# EAGLE design octobñpcksBoard (EAGLE 6.5.0)
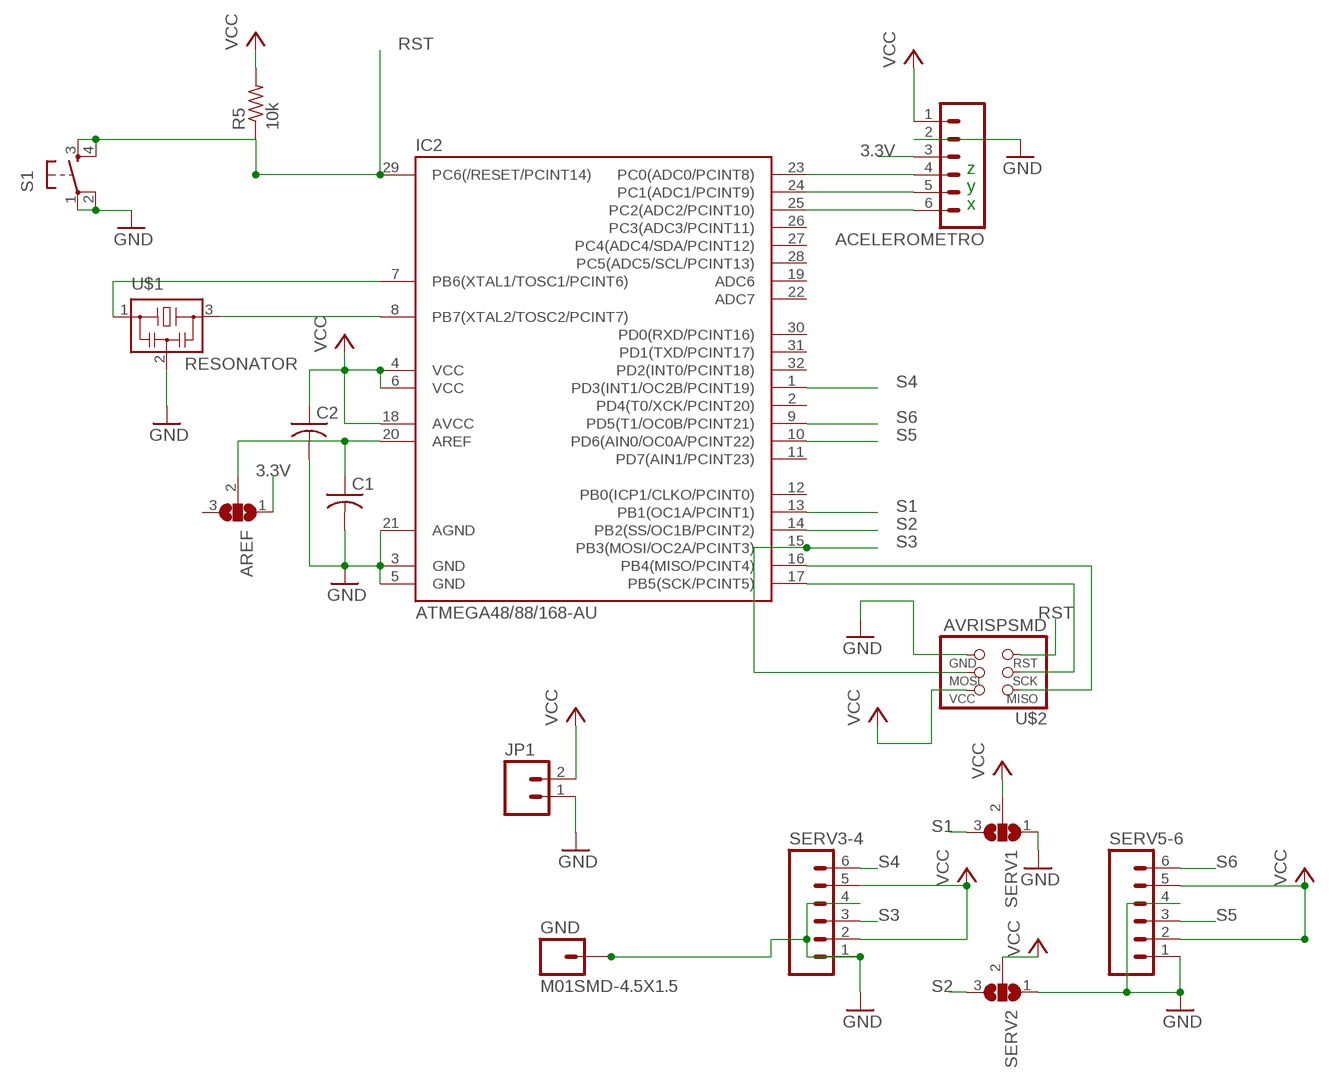
[diagram p0: schematic, sheet 1]

## Parts
ACELEROMETRO  M06SMD  [1X06-SMD]
AREF  SJ2WW  [SJ_2W]
C1  C-USC1206  [C1206]
C2  C-USC1206  [C1206]
GND  M01SMD-4.5X1.5  [PAD-1.5X4.5]
IC2  ATMEGA48/88/168-AU  [TQFP32-08]
JP1  M02  [1X02_LONGPADS]
R5  10k  RESISTOR1206  [1206]
S1  6MM_SWITCH6MM_SWITCH  [6MM_SWITCH]
SERV1  SJ2WW  [SJ_2W]
SERV2  SJ2WW  [SJ_2W]
SERV3-4  M06SMD  [1X06-SMD]
SERV5-6  M06SMD  [1X06-SMD]
U$1  RESONATOR  [EFOBM]
U$2  AVRISPSMD  [2X03SMD]

## Nets
3.3V: ACELEROMETRO.3 AREF.1
GND: ACELEROMETRO.2 C1.2 C2.2 GND.P$1 IC2.3(GND) IC2.5(GND) IC2.21(AGND) JP1.1 S1.1(P) S1.2(P1) SERV1.1 SERV2.1 SERV3-4.1 SERV3-4.4 SERV5-6.1 SERV5-6.4 U$1.2 U$2.6(GND)
N$1: IC2.17(PB5(SCK/PCINT5)) U$2.3(SCK)
N$2: ACELEROMETRO.4 IC2.23(PC0(ADC0/PCINT8))
N$3: IC2.16(PB4(MISO/PCINT4)) U$2.1(MISO)
N$4: IC2.8(PB7(XTAL2/TOSC2/PCINT7)) U$1.3
N$5: IC2.7(PB6(XTAL1/TOSC1/PCINT6)) U$1.1
N$8: AREF.2 C1.1 IC2.20(AREF)
N$9: ACELEROMETRO.5 IC2.24(PC1(ADC1/PCINT9))
N$10: ACELEROMETRO.6 IC2.25(PC2(ADC2/PCINT10))
RST: IC2.29(PC6(/RESET/PCINT14)) R5.1 S1.3(S) S1.4(S1) U$2.5(RST)
S1: IC2.13(PB1(OC1A/PCINT1)) SERV1.3
S2: IC2.14(PB2(SS/OC1B/PCINT2)) SERV2.3
S3: IC2.15(PB3(MOSI/OC2A/PCINT3)) SERV3-4.3 U$2.4(MOSI)
S4: IC2.1(PD3(INT1/OC2B/PCINT19)) SERV3-4.6
S5: IC2.10(PD6(AIN0/OC0A/PCINT22)) SERV5-6.3
S6: IC2.9(PD5(T1/OC0B/PCINT21)) SERV5-6.6
VCC: ACELEROMETRO.1 C2.1 IC2.4(VCC) IC2.6(VCC) IC2.18(AVCC) JP1.2 R5.2 SERV1.2 SERV2.2 SERV3-4.2 SERV3-4.5 SERV5-6.2 SERV5-6.5 U$2.2(VCC)
Unconnected: AREF.3 IC2.2(PD4(T0/XCK/PCINT20)) IC2.11(PD7(AIN1/PCINT23)) IC2.12(PB0(ICP1/CLKO/PCINT0)) IC2.19(ADC6) IC2.22(ADC7) IC2.26(PC3(ADC3/PCINT11)) IC2.27(PC4(ADC4/SDA/PCINT12)) IC2.28(PC5(ADC5/SCL/PCINT13)) IC2.30(PD0(RXD/PCINT16)) IC2.31(PD1(TXD/PCINT17)) IC2.32(PD2(INT0/PCINT18))

## Notes on the sheet
- z
- y
- x

## Library data of the parts
ACELEROMETRO SERV3-4 SERV5-6 = 01_SparkFun:M06: Header 6 Standard 6-pin 0.1" header. Use with straight break away headers (SKU : PRT-00116), right angle break away headers (PRT-00553), swiss pins (PRT-00743), machine pins (PRT-00117), and female headers (PRT-00115). Molex polarized connector foot print use with SKU : PRT-08094 with associated crimp pins and housings. NOTES ON THE VARIANTS LOCK and LOCK_LONGPADS... This footprint was designed to help hold the alignment of a through-hole component (i.e. 6-pin header) while soldering it into place. You may notice that each hole has been shifted either up or down by 0.005 of an inch from it's more standard position (which is a perfectly straight line). This slight alteration caused the pins (the squares in the middle) to touch the edges of the holes. Because they are alternating, it causes a "brace" to hold the component in place. 0.005 has proven to be the perfect amount of "off-center" position when using our standard breakaway headers. Although looks a little odd when you look at the bare footprint, once you have a header in there, the alteration is very hard to notice. Also, if you push a header all the way into place, it is covered up entirely on the bottom side. This idea of altering the position of holes to aid alignment will be further integrated into the Sparkfun Library for other footprints. It can help hold any component with 3 or more connection pins.
AREF SERV1 SERV2 = jumper:SJ2W: SMD solder JUMPER
C1 C2 = 01_adafruit:C-US: CAPACITOR, American symbol
GND = 01_SparkFun:M01: Header 1 Standard 1-pin 0.1" header. Use with straight break away headers (SKU : PRT-00116), right angle break away headers (PRT-00553), swiss pins (PRT-00743), machine pins (PRT-00117), and female headers (PRT-00115).
IC2 = 01_atmega8:ATMEGA48/88/168
JP1 = 01_SparkFun:M02: Header 2 Standard 2-pin 0.1" header. Use with straight break away headers (SKU : PRT-00116), right angle break away headers (PRT-00553), swiss pins (PRT-00743), machine pins (PRT-00117), and female headers (PRT-00115). Molex polarized connector foot print use with SKU : PRT-08233 with associated crimp pins and housings.
R5 = 01_ng:RESISTOR
S1 = 01_FAB_Hello:6MM_SWITCH: OMRON SWITCH
U$1 = 01_fab:RESONATOR
U$2 = 01_fab:AVRISP

## Board
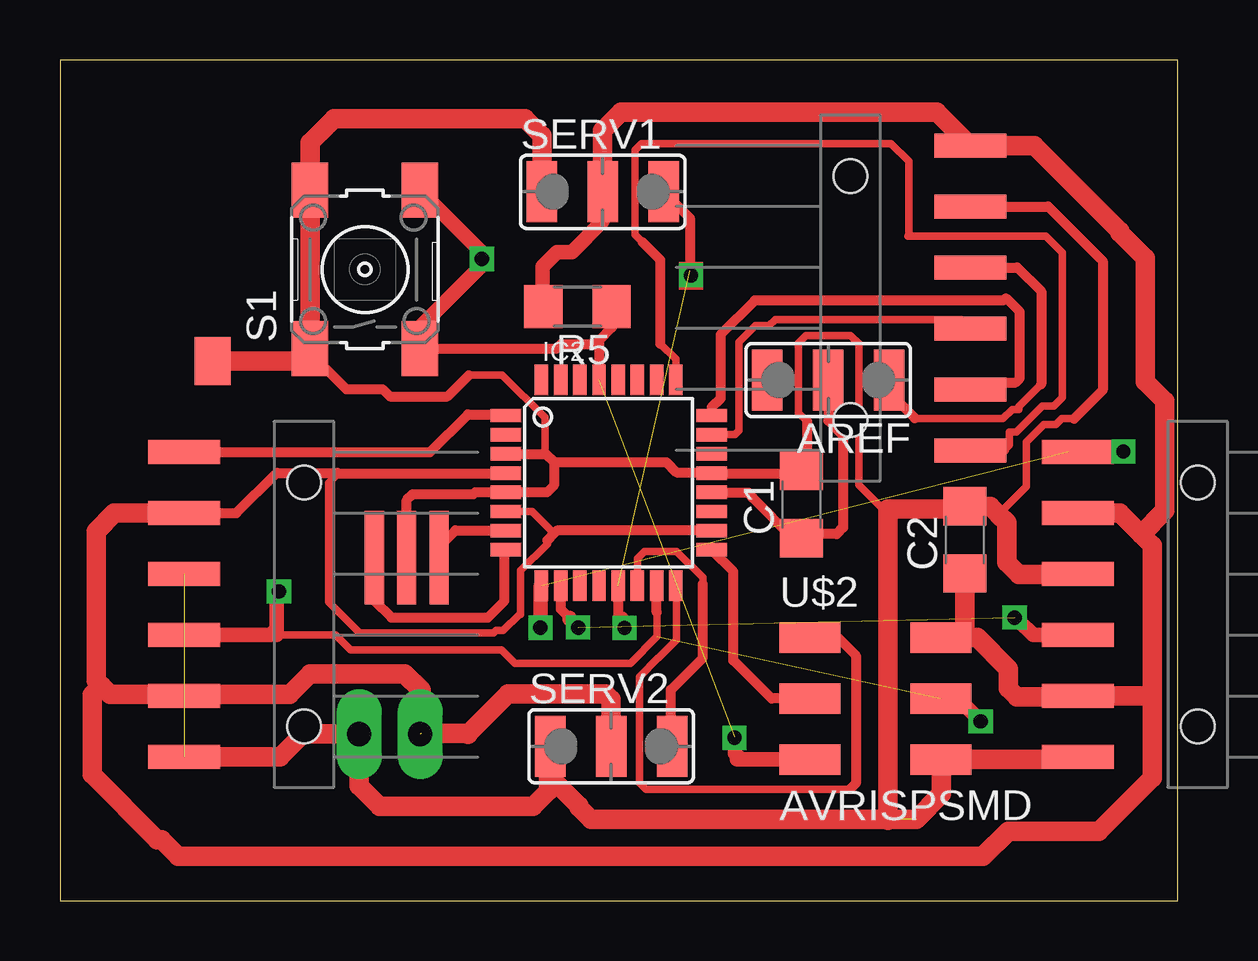
[diagram p1: board, top side]

Size 46.6 x 35.04 mm. Coordinates in mm from the lower left corner, seen from the top.
Outline: 0,0 46.6,0 46.6,35.04 0,35.04 0,0
Copper layers (1*16): Top 0.035mm / dielectric 1.5mm / Bottom 0.035mm
Design rules "default": minimum track width 10mil, minimum drill 24mil, track to track 8mil, track to pad 8mil, pad to pad 8mil, via to via 8mil, smd to smd 8mil, copper to edge 40mil, drill to drill 8mil, minimum pad ring 10mil, minimum via ring 8mil, stop-mask expansion 4mil, vias tented up to drill 0mil, thermal gap 10mil

### Footprints (pad centres in the part's own frame; a part is rotated, then mirrored left to right if it is on the bottom)
1X06-SMD = smd 1 x 3: 1 -6.35,5; 2 -3.81,5; 3 -1.27,5; 4 1.27,5; 5 3.81,5; 6 6.35,5 | hole 1.4: -5.08,0; 5.08,0
SJ_2W = smd 1.27 x 2.54: 1 -2.54,0; 2 0,0; 3 2.54,0
C1206 = smd 1.6 x 1.8: 1 -1.4,0; 2 1.4,0
PAD-1.5X4.5 = smd 1.5 x 2: P$1 0,0
TQFP32-08 = smd 1.27 x 0.559: 1 -4.293,2.8; 2 -4.293,2; 3 -4.293,1.2; 4 -4.293,0.4; 5 -4.293,-0.4; 6 -4.293,-1.2; 7 -4.293,-2; 8 -4.293,-2.8; 17 4.293,-2.8; 18 4.293,-2; 19 4.293,-1.2; 20 4.293,-0.4; 21 4.293,0.4; 22 4.293,1.2; 23 4.293,2; 24 4.293,2.8 | smd 0.559 x 1.27: 9 -2.8,-4.293; 10 -2,-4.293; 11 -1.2,-4.293; 12 -0.4,-4.293; 13 0.4,-4.293; 14 1.2,-4.293; 15 2,-4.293; 16 2.8,-4.293; 25 2.8,4.293; 26 2,4.293; 27 1.2,4.293; 28 0.4,4.293; 29 -0.4,4.293; 30 -1.2,4.293; 31 -2,4.293; 32 -2.8,4.293
1X02_LONGPADS = drill 1.016 pad 1.88 long: 1 0,0; 2 2.54,0
1206 = smd 1.6 x 1.803: 1 -1.422,0; 2 1.422,0
6MM_SWITCH = smd 2.286 x 1.524: 1 -3.302,2.286; 2 3.302,2.286; 3 -3.302,-2.286; 4 3.302,-2.286
EFOBM = smd 0.8 x 3.9: 1 -1.35,0; 2 0,0; 3 1.35,0
2X03SMD = smd 2.54 x 1.27: 1 -2.54,2.54; 2 2.92,2.54; 3 -2.54,0; 4 2.92,0; 5 -2.54,-2.54; 6 2.92,-2.54

### Placement (x,y rotation side)
ACELEROMETRO  32.94,25.12 270 top
AREF  32.03,21.7 180 top
C1  30.91,16.51 90 top
C2  37.72,15.04 90 top
GND  6.36,22.5 0 top
IC2  22.87,17.42 0 top
JP1  12.47,6.94 0 top
R5  21.57,24.76 180 top
S1  12.71,26.31 90 top
SERV1  22.62,29.55 0 top
SERV2  22.97,6.44 0 top
SERV3-4  10.17,12.34 90 top
SERV5-6  47.43,12.34 90 top
U$1  14.45,14.29 180 top
U$2  33.8,8.42 0 top

### Tracks (layer width: path | path; a pad name or v marks a point on that pad's centre or on a via)
3.3V
  Top 0.305: 35.63,20.11 35.64,20.09 39.31,20.09 39.69,20.47 39.97,20.47 39.97,20.6 40.9,21.53
  Top 0.406: 35.63,20.11 34.57,21.17 AREF.1 | ACELEROMETRO.3 39.91,26.4 40.9,25.4 40.9,21.53
GND  (2 unrouted)
  Top 0.305: 17.04,21.91 18.44,21.91 20.21,20.13 20.21,18.66 20.25,18.62 | 42.28,20.1 41.76,20.1 41.52,19.85 41.02,19.85 40.28,19.11 40.28,17.25 39.12,16.1 | 31.14,19.99 30.79,20.34 30.79,23.25 31.1,23.56 32.96,23.56 33.3,23.22 33.3,17.32 34.51,16.11
  Top 0.406: U$1.2 14.45,16.69 14.71,16.95 17.23,16.95 17.31,17.03 IC2.5 20.3,17.02 20.59,17.31 20.59,18.28 | IC2.3 20.25,18.62 20.59,18.28 | 20.59,18.28 25.28,18.28 25.7,17.85 27.14,17.85 IC2.21 27.18,17.8 31.08,17.8 C1.2 31.14,18.14 31.14,19.99 | 9.92,22.5 10.76,22.5 11.93,21.32 13.44,21.32 13.75,21.01 16.15,21.01 17.04,21.91 | ACELEROMETRO.2 41.2,28.93 43.47,26.66 43.47,21.28 42.28,20.1
  Top 0.61: C2.2 37.6,16.56
  Top 0.813: SERV3-4.1 9.18,5.99 10.14,6.96 12.46,6.96 JP1.1 12.47,4.78 13.33,3.93 19.71,3.93 20.36,4.58 20.36,6.37 SERV2.1 20.43,5.15 21.63,3.95 21.63,3.9 22.14,3.4 35.69,3.4 36.74,4.45 36.74,5.86 U$2.6 41.89,5.88 SERV5-6.1 | GND.P$1 9.92,22.5 S1.1 S1.2 10.42,31.6 11.43,32.6 19.38,32.6 20.09,31.89 SERV1.1 | SERV5-6.4 41.98,13.59 39.97,13.59 39.47,14.09 39.47,15.75 39.12,16.1 38.79,16.44 C2.2 | 34.56,3.4 34.51,3.34 34.51,16.11 34.51,16.33 37.37,16.33 37.6,16.56
N$1
  Top 0.406: U$2.3 29.66,8.42 28.07,10.01 28.07,13.71 IC2.17
N$2
  Top 0.305: IC2.23 28.13,19.42 28.3,19.59 28.3,23.28 28.99,23.96 29.56,23.96 29.82,24.22 37.57,24.22 ACELEROMETRO.4
  Top 0.406: ACELEROMETRO.4 37.83,23.96
N$3
  Top 0.305: 32.93,4.65 24.42,4.65 24.15,4.91 24.15,9.33 24.94,10.11 24.95,10.11 25.7,10.86 25.7,13.1 IC2.16
  Top 0.406: 32.08,10.97 32.07,10.96 | U$2.1 32.42,10.96 33.17,10.22 33.17,4.88 32.93,4.65
  Top 0.813: U$2.1 32.07,10.96
N$4
  Top 0.406: 18.56,14.61 IC2.8 18.53,14.57 18.53,12.5 17.84,11.8 13.81,11.8 13.1,12.51 U$1.3
N$5
  Top 0.406: IC2.7 16.49,15.43 15.8,14.75 U$1.1
N$6  (via drill 0.6)
  other vias: 23.53,11.37
N$7  (via drill 0.6)
  other vias: 39.79,11.8
N$8
  Top 0.305: 27.19,16.99 27.21,16.98
  Top 0.406: 27.19,16.99 IC2.20 27.19,17 28.7,17 28.86,16.84 28.86,16.8 30.6,15.06 C1.1 31.07,15.28 32.38,15.28 32.64,15.54 32.64,19.39 32.03,20.01 AREF.2
N$9
  Top 0.406: ACELEROMETRO.5 38.23,21.6 39.84,21.6 40.01,21.77 40.01,24.55 39.46,25.09 39.39,25.09 39.32,25.02 28.96,25.02 27.53,23.59 27.53,20.94 27.16,20.57 IC2.24
N$10
  Top 0.305: IC2.25 25.67,22.57 25.02,23.22 | 24.3,27.44 23.98,27.76 23.98,31.29 24.25,31.56 34.63,31.56 35.38,30.82 35.38,27.73 35.35,27.7 41.1,27.7 41.78,27.02 41.78,20.97 41.43,20.62 40.95,20.62 39.87,19.54 39.58,19.54 39.58,18.99 39.35,18.76
  Top 0.406: 37.94,18.96 38.14,18.76 39.35,18.76 | 24.3,27.44 25.02,26.72 25.02,23.22
  Top 0.61: 37.94,18.96 ACELEROMETRO.6
N$11  (via drill 0.6)
  other vias: 38.37,7.47
N$12  (via drill 0.6)
  other vias: 26.3,26.07
N$13  (via drill 0.6)
  other vias: 28.11,6.79
N$14  (via drill 0.6)
  other vias: 17.58,26.75
N$15  (via drill 0.6)
  other vias: 9.12,12.89
RST  (1 unrouted)
  Top 0.406: R5.1 22.99,23.88 22.46,23.35 22.46,23.24 | 22.46,23.24 IC2.29 | S1.3 20.69,23.01 20.89,23.2 22.42,23.2 22.46,23.24 | 31.68,5.88 U$2.5 30.87,5.88
  Top 0.61: 30.87,5.88 30.86,5.89 28.22,5.89 28.31,5.98 | 28.31,5.98 | 28.31,5.98 28.14,6.15 28.14,6.83 | S1.4 17.58,27.03 17.58,26.47 15,23.88 S1.3
S1  (1 unrouted)
  Top 0.305: 23.26,12.53 23.26,12.45
  Top 0.406: 23.26,12.53 23.26,13.12 IC2.13 23.27,11.91 23.41,11.77 | SERV1.3 26.25,28.46 26.25,26.27
  Top 0.61: 23.41,11.77 23.41,11.48 23.55,11.34
S2
  Top 0.305: 24.1,13.16 IC2.14 24.07,14.27 24.36,14.56 25.69,14.56 25.79,14.46 25.81,14.46 26.8,13.47 26.8,13.2 26.8,13.19
  Top 0.406: 24.05,13.11 IC2.14 | SERV2.3 25.46,6.49 25.46,8.79 26.8,10.13 26.8,13.19
S3  (1 unrouted)
  Top 0.305: 24.87,12.03 24.89,12.01 24.89,11.01 23.77,9.89 18.97,9.89 18.41,10.45 12.11,10.45 11.49,11.07 9.02,11.07
  Top 0.406: 24.87,12.03 IC2.15
  Top 0.61: U$2.4 37.42,8.42 38.32,7.53 | 9.02,11.07 | 9.02,11.07 9.02,11.32 | 9.02,11.32 9.02,12.75 9.26,12.99 | SERV3-4.3 8.78,11.07 9.02,11.32
S4
  Top 0.406: SERV3-4.6 15.42,18.69 17,20.27 18.53,20.27 IC2.1
S5  (via drill 0.6)  (1 unrouted)
  Top 0.406: IC2.10 20.87,12.15 21.24,11.78
  Top 0.61: 21.24,11.78 21.24,11.74 v21.6,11.38 | SERV5-6.3 40.56,11.07 39.97,11.67 39.95,11.67 39.81,11.81
S6  (via drill 0.6)  (1 unrouted)
  Top 0.61: IC2.9 20.02,13.08 v20.02,11.38 20.02,11.35 | SERV5-6.6 42.03,18.72 44.28,18.72
  Top 0.813: 44.28,18.72 v44.32,18.72 44.38,18.72
VCC  (1 unrouted)
  Top 0.305: 20.32,15.02 20.32,14.87 19.2,13.75 19.2,11.94 19.15,11.94 18.48,11.27 18.18,11.27 18.07,11.16 12.48,11.16 11.2,12.45 11.2,17.42 11.59,17.81 | IC2.6 19.67,16.22 20.59,15.3
  Top 0.406: IC2.4 18.57,17.81 11.59,17.81 11.57,17.83 9.03,17.83 7.35,16.15 SERV3-4.5 | IC2.18 20.72,15.42 20.59,15.3 20.32,15.02
  Top 0.61: SERV1.2 22.62,28.32 21.34,27.04 20.72,27.04 20.11,26.42 20.11,24.8 R5.2
  Top 0.813: SERV3-4.5 2.27,16.15 1.5,15.39 1.5,9.18 1.73,8.96 | 1.73,8.96 2.1,8.59 5.11,8.59 | SERV5-6.5 44.19,16.15 45.07,15.27 | 45.07,15.27 45.54,14.8 45.54,8.5 | 45.54,8.5 45.54,5.12 43.31,2.9 39.53,2.9 38.48,1.84 4.93,1.84 4.23,2.54 4.06,2.54 1.34,5.26 1.34,8.57 1.73,8.96 | 17,6.94 17.03,6.97 | SERV2.2 22.98,8.38 22.74,8.62 18.68,8.62 17.03,6.97 | U$2.2 37.4,10.96 | 37.4,10.96 38.23,10.96 39.53,9.66 39.53,8.84 39.88,8.49 41.96,8.49 SERV5-6.2 42,8.54 45.5,8.54 45.54,8.5 | 5.26,8.62 SERV3-4.2 5.11,8.59 | 5.11,8.59 9.57,8.59 10.43,9.45 14.37,9.45 15.04,8.78 15.04,6.97 17.03,6.97 | SERV1.2 22.62,32.09 23.39,32.86 36.55,32.86 ACELEROMETRO.1 40.61,31.47 44.17,27.91 44.17,27.84 45.24,26.78 45.24,21.63 46.05,20.82 46.05,16.25 45.07,15.27 | C2.1 37.72,11.28 37.4,10.96
(copper drawn outside any net)
  shapes: Top area x1